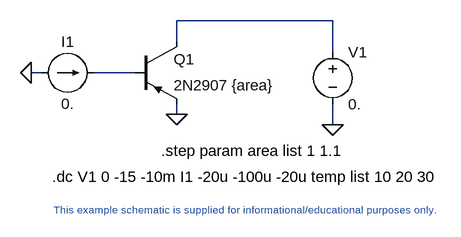
[diagram p0: schematic curvetrace3.asc]
curvetrace3.asc, the LTspice schematic file:
Version 4
SHEET 1 2888 1752
WIRE 2224 1168 1984 1168
WIRE 1984 1200 1984 1168
WIRE 2224 1216 2224 1168
WIRE 1776 1248 1760 1248
WIRE 1920 1248 1856 1248
WIRE 1984 1312 1984 1296
WIRE 2224 1328 2224 1296
FLAG 2224 1328 0
FLAG 1984 1312 0
FLAG 1760 1248 0
SYMBOL voltage 2224 1200 R0
SYMATTR InstName V1
SYMATTR Value 0.
SYMBOL current 1776 1248 M90
WINDOW 0 -32 40 VBottom 2
WINDOW 3 32 40 VTop 2
SYMATTR InstName I1
SYMATTR Value 0.
SYMBOL pnp 1920 1200 R0
WINDOW 0 59 27 Left 2
WINDOW 3 59 67 Left 2
SYMATTR InstName Q1
SYMATTR Value 2N2907 {area}
TEXT 1792 1408 Left 2 !.dc V1 0 -15 -10m I1 -20u -100u -20u temp list 10 20 30
TEXT 2080 1448 Top 1 ;This example schematic is supplied for informational/educational purposes only.
TEXT 1960 1368 Left 2 !.step param area list 1 1.1

The netlist it stands for:
* curvetrace3.asc
V1 N001 0 0.
I1 0 N002 0.
Q1 N001 N002 0 0 2N2907 {area}
.model NPN NPN
.model PNP PNP
.lib standard.bjt
.dc V1 0 -15 -10m I1 -20u -100u -20u temp list 10 20 30
* This example schematic is supplied for informational/educational purposes only.
.step param area list 1 1.1
.backanno
.end